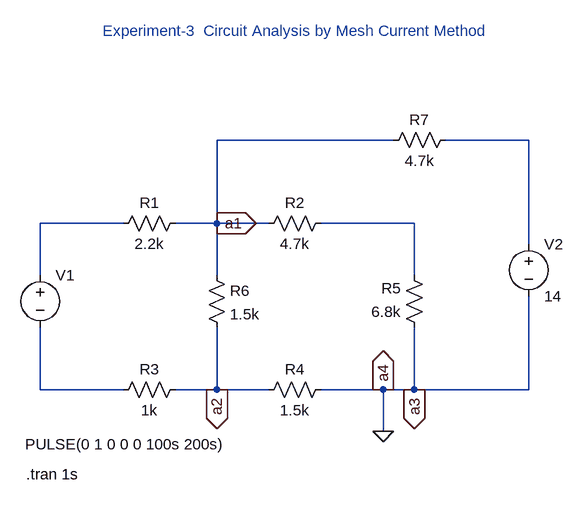
[diagram p0: schematic Draft11.asc]
Draft11.asc, the LTspice schematic file:
Version 4
SHEET 1 880 680
WIRE 304 -16 32 -16
WIRE 512 -16 384 -16
WIRE -112 112 -240 112
WIRE 32 112 32 -16
WIRE 32 112 -32 112
WIRE 112 112 32 112
WIRE 336 112 192 112
WIRE 512 144 512 -16
WIRE -240 192 -240 112
WIRE 32 192 32 112
WIRE 336 192 336 112
WIRE -240 368 -240 272
WIRE -112 368 -240 368
WIRE 32 368 32 272
WIRE 32 368 -32 368
WIRE 112 368 32 368
WIRE 288 368 192 368
WIRE 336 368 336 272
WIRE 336 368 288 368
WIRE 512 368 512 224
WIRE 512 368 336 368
WIRE 288 432 288 368
FLAG 288 432 0
FLAG 32 368 a2
IOPIN 32 368 Out
FLAG 336 368 a3
IOPIN 336 368 Out
FLAG 288 368 a4
IOPIN 288 368 Out
FLAG 32 112 a1
IOPIN 32 112 Out
SYMBOL res -16 96 R90
WINDOW 0 0 56 VBottom 2
WINDOW 3 32 56 VTop 2
SYMATTR InstName R1
SYMATTR Value 2.2k
SYMBOL res 208 96 R90
WINDOW 0 0 56 VBottom 2
WINDOW 3 32 56 VTop 2
SYMATTR InstName R2
SYMATTR Value 4.7k
SYMBOL res -16 352 R90
WINDOW 0 0 56 VBottom 2
WINDOW 3 32 56 VTop 2
SYMATTR InstName R3
SYMATTR Value 1k
SYMBOL res 208 352 R90
WINDOW 0 0 56 VBottom 2
WINDOW 3 32 56 VTop 2
SYMATTR InstName R4
SYMATTR Value 1.5k
SYMBOL res 352 288 R180
WINDOW 0 36 76 Left 2
WINDOW 3 36 40 Left 2
SYMATTR InstName R5
SYMATTR Value 6.8k
SYMBOL res 16 176 R0
SYMATTR InstName R6
SYMATTR Value 1.5k
SYMBOL res 400 -32 R90
WINDOW 0 0 56 VBottom 2
WINDOW 3 32 56 VTop 2
SYMATTR InstName R7
SYMATTR Value 4.7k
SYMBOL voltage 512 128 R0
SYMATTR InstName V2
SYMATTR Value 14
SYMBOL voltage -240 176 R0
WINDOW 3 -23 276 Left 2
WINDOW 123 0 0 Left 0
WINDOW 39 0 0 Left 0
SYMATTR InstName V1
SYMATTR Value PULSE(0 1 0 0 0 100s 200s)
TEXT -144 -184 Left 2 ;Experiment-3  Circuit Analysis by Mesh Current Method
TEXT -262 498 Left 2 !.tran 1s

The netlist it stands for:
* Draft11.asc
R1 a1 N002 2.2k
R2 N003 a1 4.7k
R3 a2 N004 1k
R4 0 a2 1.5k
R5 0 N003 6.8k
R6 a1 a2 1.5k
R7 N001 a1 4.7k
V2 N001 0 14
V1 N002 N004 PULSE(0 1 0 0 0 100s 200s)
* Experiment-3  Circuit Analysis by Mesh Current Method
.tran 1s
.backanno
.end

* Results of the author's LTspice run, read from the files saved beside the schematic
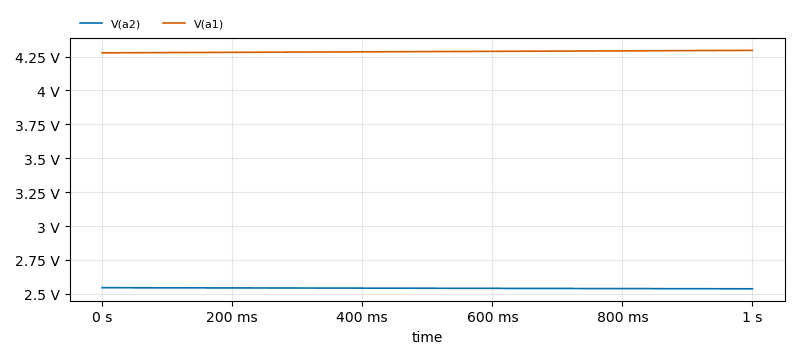
[diagram p1: Transient Analysis of Draft11.asc, plotted from the saved traces]
* Transient Analysis, 1 run:
*   V(a2): min 2.537 V, max 2.545 V, average 2.541 V, rms 2.541 V, last 2.537 V
*   V(a1): min 4.278 V, max 4.296 V, average 4.287 V, rms 4.287 V, last 4.296 V